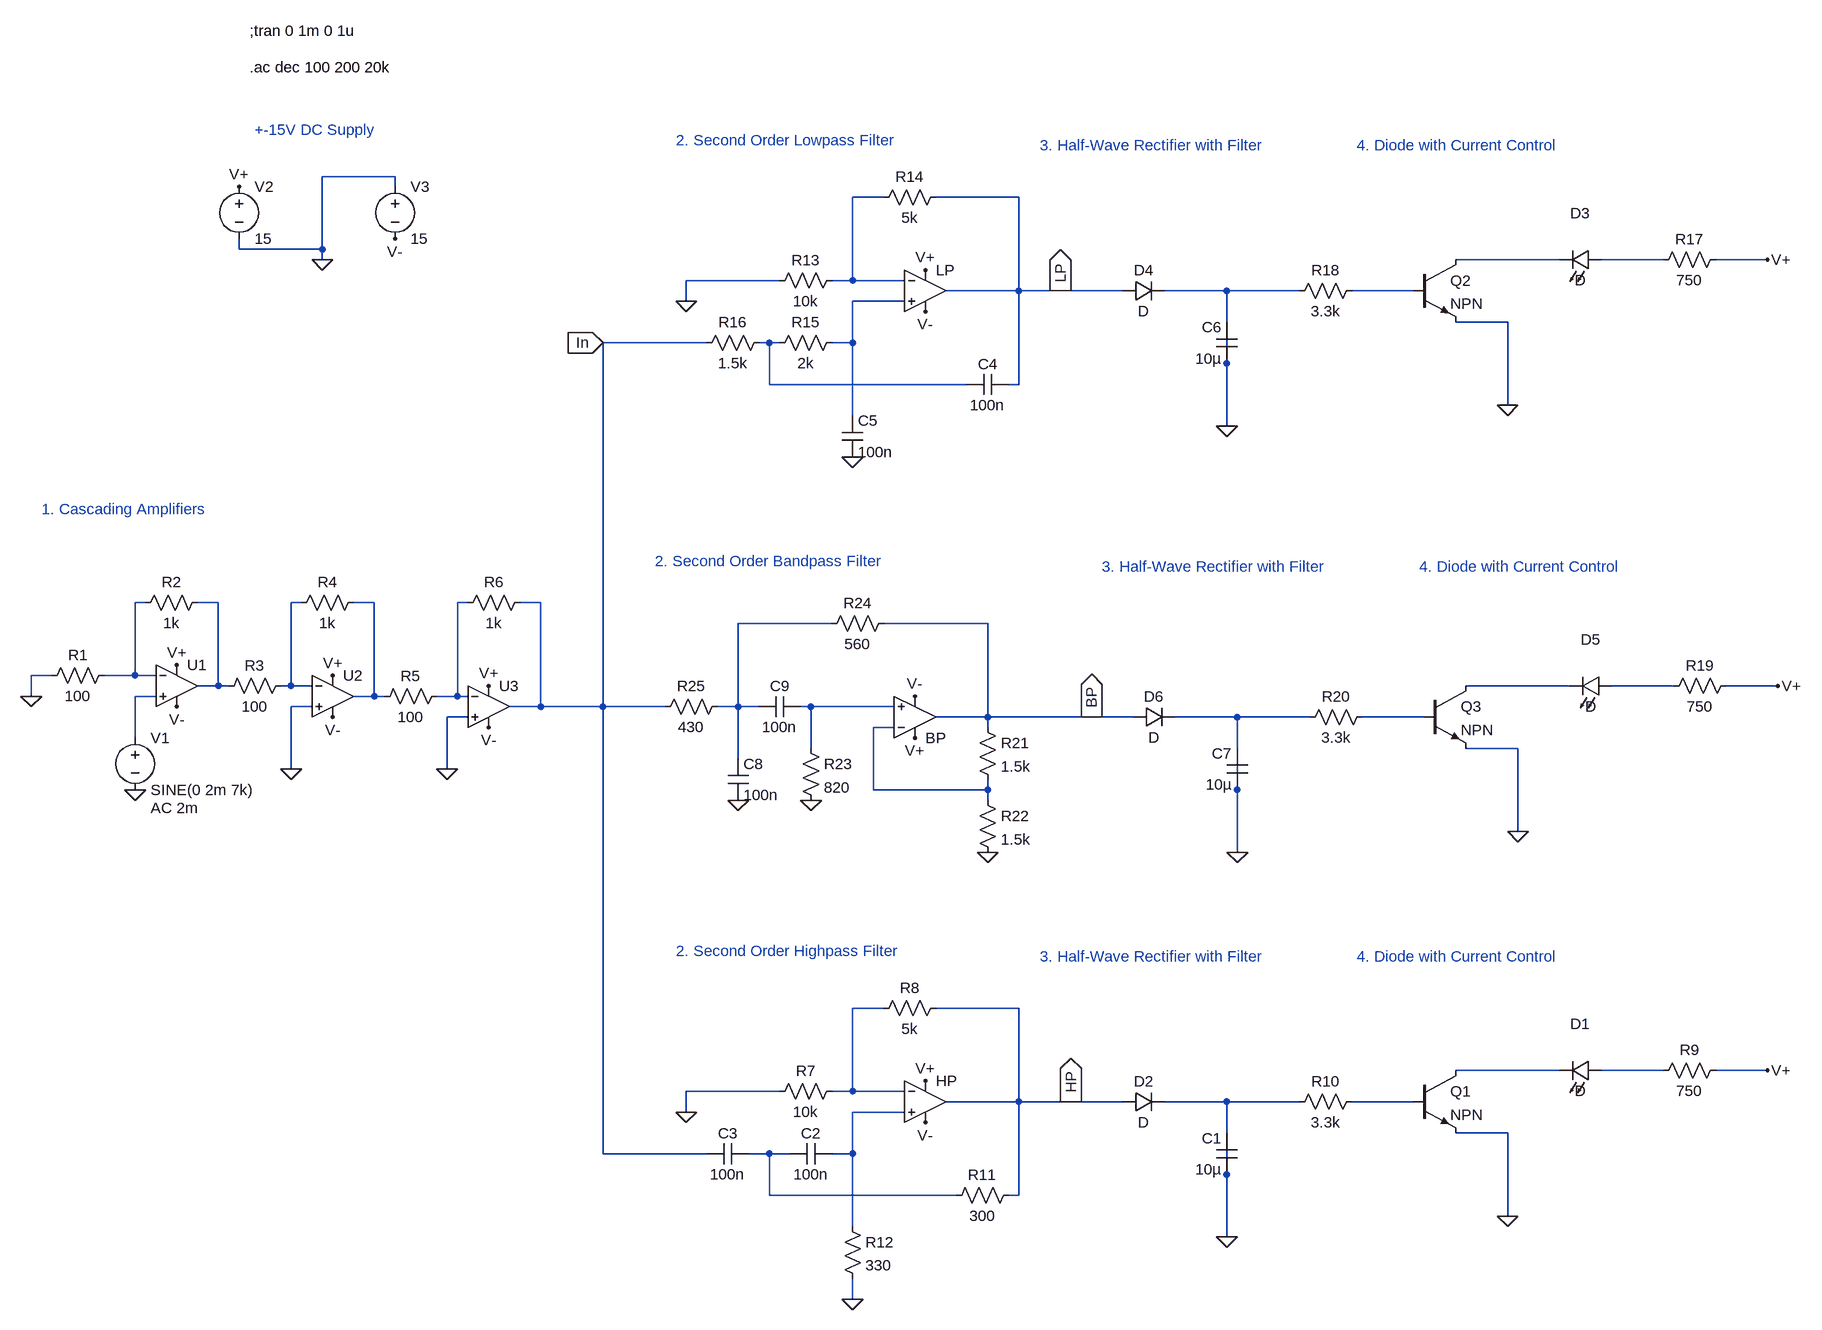
[diagram p0: schematic SoundResopnseLEDCircuit.asc]
SoundResopnseLEDCircuit.asc, the LTspice schematic file:
Version 4
SHEET 1 4052 1332
WIRE -144 -576 -256 -576
WIRE -144 -560 -144 -576
WIRE 608 -544 560 -544
WIRE 816 -544 688 -544
WIRE -384 -464 -384 -480
WIRE -256 -464 -256 -576
WIRE -256 -464 -384 -464
WIRE -256 -448 -256 -464
WIRE 1648 -448 1488 -448
WIRE 1808 -448 1712 -448
WIRE 1968 -448 1888 -448
WIRE 448 -416 304 -416
WIRE 560 -416 560 -544
WIRE 560 -416 528 -416
WIRE 640 -416 560 -416
WIRE 816 -400 816 -544
WIRE 816 -400 704 -400
WIRE 880 -400 816 -400
WIRE 976 -400 880 -400
WIRE 1136 -400 1040 -400
WIRE 1248 -400 1136 -400
WIRE 1424 -400 1328 -400
WIRE 304 -384 304 -416
WIRE 640 -384 560 -384
WIRE 1136 -352 1136 -400
WIRE 1568 -352 1488 -352
WIRE 336 -320 176 -320
WIRE 432 -320 416 -320
WIRE 448 -320 432 -320
WIRE 560 -320 560 -384
WIRE 560 -320 528 -320
WIRE 1136 -288 1136 -336
WIRE 432 -256 432 -320
WIRE 736 -256 432 -256
WIRE 816 -256 816 -400
WIRE 816 -256 800 -256
WIRE 1568 -224 1568 -352
WIRE 560 -208 560 -320
WIRE 1136 -192 1136 -288
WIRE -528 80 -544 80
WIRE -416 80 -448 80
WIRE -288 80 -304 80
WIRE -176 80 -208 80
WIRE -32 80 -48 80
WIRE 80 80 48 80
WIRE 528 112 384 112
WIRE 768 112 608 112
WIRE -672 192 -704 192
WIRE -544 192 -544 80
WIRE -544 192 -592 192
WIRE -512 192 -544 192
WIRE -416 208 -416 80
WIRE -416 208 -448 208
WIRE -400 208 -416 208
WIRE -304 208 -304 80
WIRE -304 208 -320 208
WIRE -272 208 -304 208
WIRE 1664 208 1504 208
WIRE 1824 208 1728 208
WIRE 1984 208 1904 208
WIRE -704 224 -704 192
WIRE -512 224 -544 224
WIRE -176 224 -176 80
WIRE -176 224 -208 224
WIRE -160 224 -176 224
WIRE -48 224 -48 80
WIRE -48 224 -80 224
WIRE -32 224 -48 224
WIRE -272 240 -304 240
WIRE 80 240 80 80
WIRE 80 240 32 240
WIRE 176 240 176 -320
WIRE 176 240 80 240
WIRE 272 240 176 240
WIRE 384 240 384 112
WIRE 384 240 352 240
WIRE 416 240 384 240
WIRE 496 240 480 240
WIRE 624 240 496 240
WIRE -32 256 -64 256
WIRE 768 256 768 112
WIRE 768 256 688 256
WIRE 928 256 768 256
WIRE 992 256 928 256
WIRE 1152 256 1056 256
WIRE 1264 256 1152 256
WIRE 1440 256 1344 256
WIRE 624 272 592 272
WIRE 768 272 768 256
WIRE -544 288 -544 224
WIRE 496 304 496 240
WIRE 1152 304 1152 256
WIRE 1584 304 1504 304
WIRE 384 320 384 240
WIRE -304 336 -304 240
WIRE -64 336 -64 256
WIRE 592 368 592 272
WIRE 768 368 768 352
WIRE 768 368 592 368
WIRE 1152 368 1152 320
WIRE 768 384 768 368
WIRE 1584 432 1584 304
WIRE 1152 464 1152 368
WIRE 608 704 560 704
WIRE 816 704 688 704
WIRE 1648 800 1488 800
WIRE 1808 800 1712 800
WIRE 1968 800 1888 800
WIRE 448 832 304 832
WIRE 560 832 560 704
WIRE 560 832 528 832
WIRE 640 832 560 832
WIRE 816 848 816 704
WIRE 816 848 704 848
WIRE 896 848 816 848
WIRE 976 848 896 848
WIRE 1136 848 1040 848
WIRE 1248 848 1136 848
WIRE 1424 848 1328 848
WIRE 304 864 304 832
WIRE 640 864 560 864
WIRE 1136 896 1136 848
WIRE 1568 896 1488 896
WIRE 176 928 176 240
WIRE 336 928 176 928
WIRE 432 928 400 928
WIRE 464 928 432 928
WIRE 560 928 560 864
WIRE 560 928 528 928
WIRE 1136 960 1136 912
WIRE 432 992 432 928
WIRE 720 992 432 992
WIRE 816 992 816 848
WIRE 816 992 800 992
WIRE 1568 1024 1568 896
WIRE 560 1040 560 928
WIRE 1136 1056 1136 960
WIRE 560 1152 560 1120
FLAG 0 208 V+
FLAG -240 192 V+
FLAG -480 176 V+
FLAG 0 272 V-
FLAG -240 256 V-
FLAG -480 240 V-
FLAG -704 224 0
FLAG -304 336 0
FLAG -64 336 0
FLAG -544 368 0
FLAG 672 816 V+
FLAG 304 864 0
FLAG 672 880 V-
FLAG 1568 1024 0
FLAG 1136 1056 0
FLAG 1968 800 V+
FLAG 560 1152 0
FLAG 672 -432 V+
FLAG 304 -384 0
FLAG 560 -144 0
FLAG 672 -368 V-
FLAG 1568 -224 0
FLAG 1136 -192 0
FLAG 1968 -448 V+
FLAG 1584 432 0
FLAG 1152 464 0
FLAG 1984 208 V+
FLAG 656 288 V+
FLAG 656 224 V-
FLAG -256 -448 0
FLAG -384 -560 V+
FLAG -144 -480 V-
FLAG 176 -320 In
IOPIN 176 -320 In
FLAG 880 -400 LP
IOPIN 880 -400 Out
FLAG 928 256 BP
IOPIN 928 256 Out
FLAG 896 848 HP
IOPIN 896 848 Out
FLAG 768 464 0
FLAG 496 384 0
FLAG 384 384 0
SYMBOL OpAmps\\UniversalOpAmp -480 208 R0
SYMATTR InstName U1
SYMBOL OpAmps\\UniversalOpAmp -240 224 R0
SYMATTR InstName U2
SYMBOL OpAmps\\UniversalOpAmp 0 240 R0
SYMATTR InstName U3
SYMBOL res -576 176 R90
WINDOW 0 0 56 VBottom 2
WINDOW 3 32 56 VTop 2
SYMATTR InstName R1
SYMATTR Value 100
SYMBOL res -432 64 R90
WINDOW 0 0 56 VBottom 2
WINDOW 3 32 56 VTop 2
SYMATTR InstName R2
SYMATTR Value 1k
SYMBOL res -304 192 R90
WINDOW 0 0 56 VBottom 2
WINDOW 3 32 56 VTop 2
SYMATTR InstName R3
SYMATTR Value 100
SYMBOL res -192 64 R90
WINDOW 0 0 56 VBottom 2
WINDOW 3 32 56 VTop 2
SYMATTR InstName R4
SYMATTR Value 1k
SYMBOL res -64 208 R90
WINDOW 0 0 56 VBottom 2
WINDOW 3 32 56 VTop 2
SYMATTR InstName R5
SYMATTR Value 100
SYMBOL res 64 64 R90
WINDOW 0 0 56 VBottom 2
WINDOW 3 32 56 VTop 2
SYMATTR InstName R6
SYMATTR Value 1k
SYMBOL voltage -544 272 R0
WINDOW 123 24 124 Left 2
WINDOW 39 0 0 Left 0
SYMATTR Value2 AC 2m
SYMATTR InstName V1
SYMATTR Value SINE(0 2m 7k)
SYMBOL OpAmps/UniversalOpAmp 672 848 R0
SYMATTR InstName HP
SYMBOL res 544 816 R90
WINDOW 0 0 56 VBottom 2
WINDOW 3 32 56 VTop 2
SYMATTR InstName R7
SYMATTR Value 10k
SYMBOL res 704 688 R90
WINDOW 0 0 56 VBottom 2
WINDOW 3 32 56 VTop 2
SYMATTR InstName R8
SYMATTR Value 5k
SYMBOL npn 1424 800 R0
SYMATTR InstName Q1
SYMBOL LED 1712 816 M270
WINDOW 0 72 32 VTop 2
WINDOW 3 0 32 VBottom 2
SYMATTR InstName D1
SYMBOL res 1904 784 R90
WINDOW 0 0 56 VBottom 2
WINDOW 3 32 56 VTop 2
SYMATTR InstName R9
SYMATTR Value 750
SYMBOL diode 976 864 R270
WINDOW 0 32 32 VTop 2
WINDOW 3 0 32 VBottom 2
SYMATTR InstName D2
SYMBOL cap 1152 960 R180
WINDOW 0 24 56 Left 2
WINDOW 3 24 8 Left 2
SYMATTR InstName C1
SYMATTR Value 10µ
SYMBOL res 1344 832 R90
WINDOW 0 0 56 VBottom 2
WINDOW 3 32 56 VTop 2
SYMATTR InstName R10
SYMATTR Value 3.3k
SYMBOL res 816 976 R90
WINDOW 0 0 56 VBottom 2
WINDOW 3 32 56 VTop 2
SYMATTR InstName R11
SYMATTR Value 300
SYMBOL cap 528 912 R90
WINDOW 0 0 32 VBottom 2
WINDOW 3 32 32 VTop 2
SYMATTR InstName C2
SYMATTR Value 100n
SYMBOL cap 400 912 R90
WINDOW 0 0 32 VBottom 2
WINDOW 3 32 32 VTop 2
SYMATTR InstName C3
SYMATTR Value 100n
SYMBOL res 544 1024 R0
SYMATTR InstName R12
SYMATTR Value 330
SYMBOL OpAmps/UniversalOpAmp 672 -400 R0
SYMATTR InstName LP
SYMBOL res 544 -432 R90
WINDOW 0 0 56 VBottom 2
WINDOW 3 32 56 VTop 2
SYMATTR InstName R13
SYMATTR Value 10k
SYMBOL res 704 -560 R90
WINDOW 0 0 56 VBottom 2
WINDOW 3 32 56 VTop 2
SYMATTR InstName R14
SYMATTR Value 5k
SYMBOL res 544 -336 R90
WINDOW 0 0 56 VBottom 2
WINDOW 3 32 56 VTop 2
SYMATTR InstName R15
SYMATTR Value 2k
SYMBOL res 432 -336 R90
WINDOW 0 0 56 VBottom 2
WINDOW 3 32 56 VTop 2
SYMATTR InstName R16
SYMATTR Value 1.5k
SYMBOL cap 800 -272 R90
WINDOW 0 0 32 VBottom 2
WINDOW 3 32 32 VTop 2
SYMATTR InstName C4
SYMATTR Value 100n
SYMBOL cap 544 -208 R0
SYMATTR InstName C5
SYMATTR Value 100n
SYMBOL npn 1424 -448 R0
SYMATTR InstName Q2
SYMBOL LED 1712 -432 M270
WINDOW 0 72 32 VTop 2
WINDOW 3 0 32 VBottom 2
SYMATTR InstName D3
SYMBOL res 1904 -464 R90
WINDOW 0 0 56 VBottom 2
WINDOW 3 32 56 VTop 2
SYMATTR InstName R17
SYMATTR Value 750
SYMBOL diode 976 -384 R270
WINDOW 0 32 32 VTop 2
WINDOW 3 0 32 VBottom 2
SYMATTR InstName D4
SYMBOL cap 1152 -288 R180
WINDOW 0 24 56 Left 2
WINDOW 3 24 8 Left 2
SYMATTR InstName C6
SYMATTR Value 10µ
SYMBOL res 1344 -416 R90
WINDOW 0 0 56 VBottom 2
WINDOW 3 32 56 VTop 2
SYMATTR InstName R18
SYMATTR Value 3.3k
SYMBOL npn 1440 208 R0
SYMATTR InstName Q3
SYMBOL LED 1728 224 M270
WINDOW 0 72 32 VTop 2
WINDOW 3 0 32 VBottom 2
SYMATTR InstName D5
SYMBOL res 1920 192 R90
WINDOW 0 0 56 VBottom 2
WINDOW 3 32 56 VTop 2
SYMATTR InstName R19
SYMATTR Value 750
SYMBOL diode 992 272 R270
WINDOW 0 32 32 VTop 2
WINDOW 3 0 32 VBottom 2
SYMATTR InstName D6
SYMBOL cap 1168 368 R180
WINDOW 0 24 56 Left 2
WINDOW 3 24 8 Left 2
SYMATTR InstName C7
SYMATTR Value 10µ
SYMBOL res 1360 240 R90
WINDOW 0 0 56 VBottom 2
WINDOW 3 32 56 VTop 2
SYMATTR InstName R20
SYMATTR Value 3.3k
SYMBOL OpAmps\\UniversalOpAmp 656 256 M180
SYMATTR InstName BP
SYMBOL voltage -384 -576 R0
SYMATTR InstName V2
SYMATTR Value 15
SYMBOL voltage -144 -576 R0
SYMATTR InstName V3
SYMATTR Value 15
SYMBOL res 752 256 R0
SYMATTR InstName R21
SYMATTR Value 1.5k
SYMBOL res 752 368 R0
SYMATTR InstName R22
SYMATTR Value 1.5k
SYMBOL res 480 288 R0
SYMATTR InstName R23
SYMATTR Value 820
SYMBOL res 624 96 R90
WINDOW 0 0 56 VBottom 2
WINDOW 3 32 56 VTop 2
SYMATTR InstName R24
SYMATTR Value 560
SYMBOL res 368 224 R90
WINDOW 0 0 56 VBottom 2
WINDOW 3 32 56 VTop 2
SYMATTR InstName R25
SYMATTR Value 430
SYMBOL cap 368 320 R0
SYMATTR InstName C8
SYMATTR Value 100n
SYMBOL cap 480 224 R90
WINDOW 0 0 32 VBottom 2
WINDOW 3 32 32 VTop 2
SYMATTR InstName C9
SYMATTR Value 100n
TEXT -688 -64 Left 2 ;1. Cascading Amplifiers
TEXT 288 616 Left 2 ;2. Second Order Highpass Filter
TEXT 848 624 Left 2 ;3. Half-Wave Rectifier with Filter
TEXT 1336 624 Left 2 ;4. Diode with Current Control
TEXT 288 -632 Left 2 ;2. Second Order Lowpass Filter
TEXT 848 -624 Left 2 ;3. Half-Wave Rectifier with Filter
TEXT 1336 -624 Left 2 ;4. Diode with Current Control
TEXT 944 24 Left 2 ;3. Half-Wave Rectifier with Filter
TEXT 1432 24 Left 2 ;4. Diode with Current Control
TEXT 256 16 Left 2 ;2. Second Order Bandpass Filter
TEXT -368 -800 Left 2 !;tran 0 1m 0 1u
TEXT -360 -648 Left 2 ;+-15V DC Supply
TEXT -368 -744 Left 2 !.ac dec 100 200 20k

The netlist it stands for:
* SoundResopnseLEDCircuit.asc
XU1 N016 N008 V+ V- N009 level1 Avol=1Meg GBW=10Meg Vos=0 En=0 Enk=0 In=0 Ink=0 Rin=500Meg  ; pins In+ In- V+ V- OUT
XU2 0 N010 V+ V- N011 level1 Avol=1Meg GBW=10Meg Vos=0 En=0 Enk=0 In=0 Ink=0 Rin=500Meg  ; pins In+ In- V+ V- OUT
XU3 0 N012 V+ V- In level1 Avol=1Meg GBW=10Meg Vos=0 En=0 Enk=0 In=0 Ink=0 Rin=500Meg  ; pins In+ In- V+ V- OUT
R1 N008 0 100
R2 N009 N008 1k
R3 N010 N009 100
R4 N011 N010 1k
R5 N012 N011 100
R6 In N012 1k
V1 N016 0 SINE(0 2m 7k) AC 2m
XHP N026 N021 V+ V- HP level1 Avol=1Meg GBW=10Meg Vos=0 En=0 Enk=0 In=0 Ink=0 Rin=500Meg  ; pins In+ In- V+ V- OUT
R7 N021 0 10k
R8 HP N021 5k
Q1 N022 N025 0 0 NPN
D1 N023 N022 D
R9 V+ N023 750
D2 HP N024 D
C1 0 N024 10µ
R10 N025 N024 3.3k
R11 HP N027 300
C2 N026 N027 100n
C3 N027 In 100n
R12 N026 0 330
XLP N006 N001 V+ V- LP level1 Avol=1Meg GBW=10Meg Vos=0 En=0 Enk=0 In=0 Ink=0 Rin=500Meg  ; pins In+ In- V+ V- OUT
R13 N001 0 10k
R14 LP N001 5k
R15 N006 N007 2k
R16 N007 In 1.5k
C4 LP N007 100n
C5 N006 0 100n
Q2 N002 N005 0 0 NPN
D3 N003 N002 D
R17 V+ N003 750
D4 LP N004 D
C6 0 N004 10µ
R18 N005 N004 3.3k
Q3 N014 N019 0 0 NPN
D5 N015 N014 D
R19 V+ N015 750
D6 BP N018 D
C7 0 N018 10µ
R20 N019 N018 3.3k
XBP N017 N020 V+ V- BP level1 Avol=1Meg GBW=10Meg Vos=0 En=0 Enk=0 In=0 Ink=0 Rin=500Meg  ; pins In+ In- V+ V- OUT
V2 V+ 0 15
V3 0 V- 15
R21 BP N020 1.5k
R22 N020 0 1.5k
R23 N017 0 820
R24 BP N013 560
R25 N013 In 430
C8 N013 0 100n
C9 N017 N013 100n
.model D D
.lib standard.dio
.model NPN NPN
.model PNP PNP
.lib standard.bjt
* 1. Cascading Amplifiers
* 2. Second Order Highpass Filter
* 3. Half-Wave Rectifier with Filter
* 4. Diode with Current Control
* 2. Second Order Lowpass Filter
* 3. Half-Wave Rectifier with Filter
* 4. Diode with Current Control
* 3. Half-Wave Rectifier with Filter
* 4. Diode with Current Control
* 2. Second Order Bandpass Filter
;tran 0 1m 0 1u
* +-15V DC Supply
.ac dec 100 200 20k
.lib UniversalOpAmp1.lib
.backanno
.end